# EAGLE design picopter_tx (EAGLE 6.5.0)
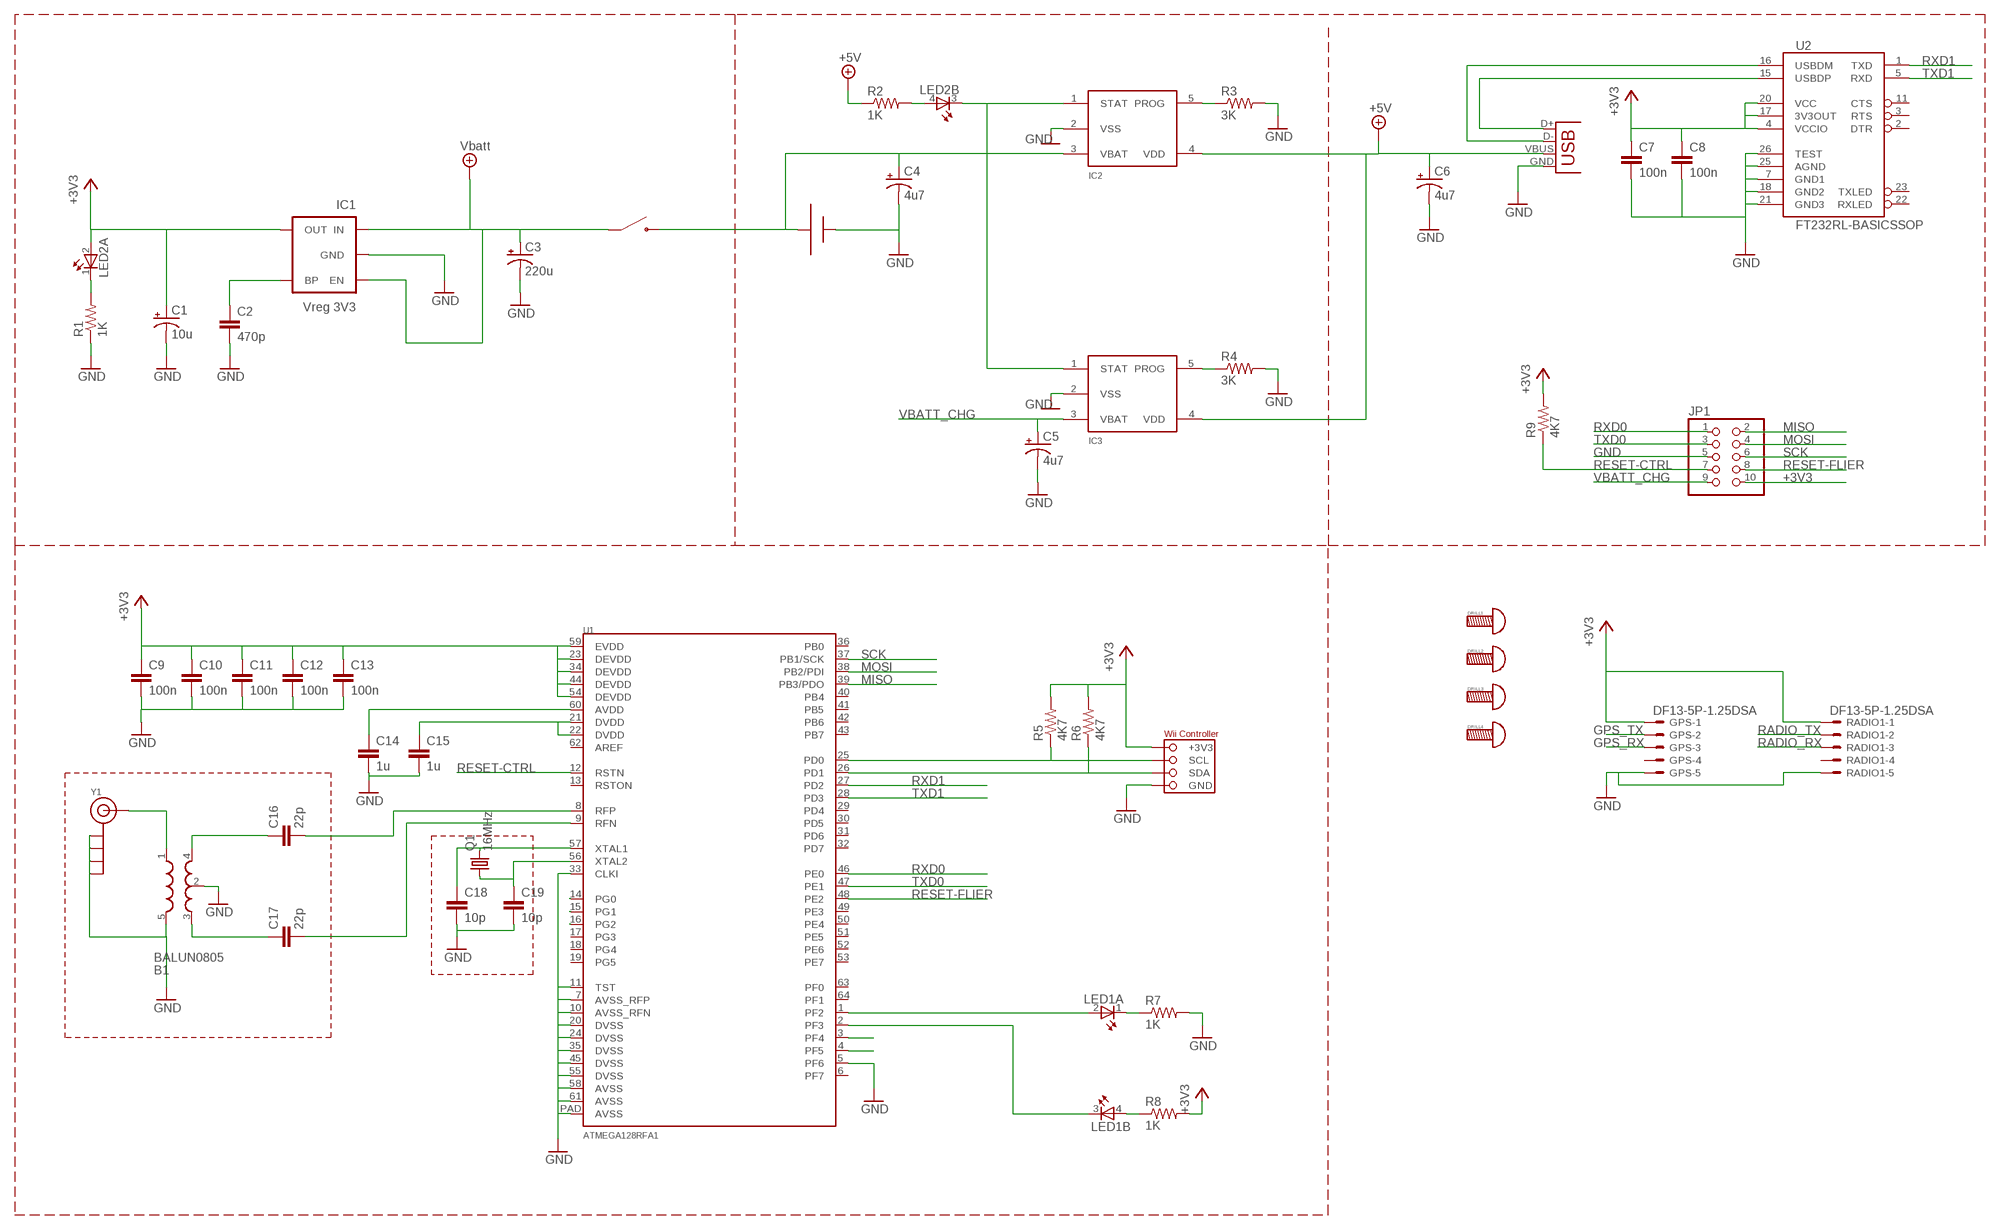
[diagram p0: schematic, sheet 1]

## Parts
B1  BALUN0805  [BALUN]
BATT2  BATT-CONNJST-PH-90  [JST-PH-2-90]
C1  10u  CPOL-USSMCB  [SMC_B]
C2  470p  C-EUC0603  [C0603]
C3  220u  CPOL-USSMCB  [SMC_B]
C4  4u7  CPOL-USSMCB  [SMC_B]
C5  4u7  CPOL-USSMCB  [SMC_B]
C6  4u7  CPOL-USSMCB  [SMC_B]
C7  100n  C-EUC0603  [C0603]
C8  100n  C-EUC0603  [C0603]
C9  100n  C-EUC0603  [C0603]
C10  100n  C-EUC0603  [C0603]
C11  100n  C-EUC0603  [C0603]
C12  100n  C-EUC0603  [C0603]
C13  100n  C-EUC0603  [C0603]
C14  1u  C-EUC0603  [C0603]
C15  1u  C-EUC0603  [C0603]
C16  22p  C-EUC0603  [C0603]
C17  22p  C-EUC0603  [C0603]
C18  10p  C-EUC0603  [C0603]
C19  10p  C-EUC0603  [C0603]
DRILL1  HOLE-4-40  [HOLE-4-40]
DRILL2  HOLE-4-40  [HOLE-4-40]
DRILL3  HOLE-4-40  [HOLE-4-40]
DRILL4  HOLE-4-40  [HOLE-4-40]
GPS  DF13-5P-1.25DSA  [DF13-5P-1.25DSA]
IC1  Vreg 3V3  V_REG_LDOSMD  [SOT23-5]
IC2  MCP-LI-CHARGER-1  [SOT23-5]
IC3  MCP-LI-CHARGER-1  [SOT23-5]
JP1  PINHD-2X5EDGE  [2X5-EDGE]
LED1  TOPLED-2-CUSTOM  [TOPLED2CUSTOM]
LED2  TOPLED-2-CUSTOM  [TOPLED2CUSTOM]
Q1  16MHz  CRYSTALCTS406  [CTS406]
R1  1K  R-US_R0603  [R0603]
R2  1K  R-US_R0603  [R0603]
R3  3K  R-US_R0603  [R0603]
R4  3K  R-US_R0603  [R0603]
R5  4K7  R-US_R0603  [R0603]
R6  4K7  R-US_R0603  [R0603]
R7  1K  R-US_R0603  [R0603]
R8  1K  R-US_R0603  [R0603]
R9  4K7  R-US_R0603  [R0603]
RADIO1  DF13-5P-1.25DSA  [DF13-5P-1.25DSA]
S1  SWITCH-PWR-CNKOS2  [SWITCH-SPDT-CNK-OS2]
U1  ATMEGA128RFA1  [QFN-64]
U2  FT232RL-BASICSSOP  [SSOP28DB]
USB  USB-SMD-NS  [USB-MINIB-NOSTOP]
X11  WII-CONN  [WII-CONN-2]
Y1  SMA_EDGE  [SMA-EDGE]

## Nets
+3V3: C1.+ C7.1 C8.1 C9.1 C10.1 C11.1 C12.1 C13.1 GPS.1 IC1.5(OUT) JP1.10 LED2.2(A:A) R5.2 R6.2 R8.2 R9.2 RADIO1.1 U1.23(DEVDD) U1.34(DEVDD) U1.44(DEVDD) U1.54(DEVDD) U1.59(EVDD) U2.4(VCCIO) U2.17(3V3OUT) U2.20(VCC) X11.+3V3
GND: B1.2(GND) B1.5(GND) BATT2.N C1.- C2.2 C3.- C4.- C5.- C6.- C7.2 C8.2 C9.2 C10.2 C11.2 C12.2 C13.2 C14.2 C15.2 C18.2 C19.2 GPS.5 IC1.2(GND) IC2.2(VSS) IC3.2(VSS) JP1.5 R1.1 R3.2 R4.2 R7.2 RADIO1.5 U1.5(PF6) U1.7(AVSS_RFP) U1.10(AVSS_RFN) U1.11(TST) U1.20(DVSS) U1.24(DVSS) U1.33(CLKI) U1.35(DVSS) U1.45(DVSS) U1.55(DVSS) U1.58(AVSS) U1.61(AVSS) U1.PAD(AVSS) U2.7(GND1) U2.18(GND2) U2.21(GND3) U2.25(AGND) U2.26(TEST) USB.GND X11.GND Y1.GND@0(GND) Y1.GND@1(GND) Y1.GND@2(GND) Y1.GND@3(GND)
GPS_RX: GPS.3
GPS_TX: GPS.2
MISO: JP1.2 U1.39(PB3/PDO)
MOSI: JP1.4 U1.38(PB2/PDI)
N$1: LED1.2(A:A) U1.1(PF2)
N$2: LED1.1(A:C) R7.1
N$3: LED1.4(B:A) R8.1
N$4: LED2.4(B:A) R2.2
N$6: U1.14(PG0)
N$7: U1.15(PG1)
N$8: U1.16(PG2)
N$9: LED2.1(A:C) R1.2
N$11: IC2.5(PROG) R3.1
N$15: IC3.5(PROG) R4.1
N$17: U2.16(USBDM) USB.D-
N$18: U2.15(USBDP) USB.D+
N$21: U1.3(PF4)
N$22: U1.4(PF5)
N$25: C2.1 IC1.4(BP)
N$26: C15.1 U1.21(DVDD) U1.22(DVDD)
N$27: C14.1 U1.60(AVDD)
N$28: B1.1(IN) Y1.SIG(SIGNAL)
N$29: B1.3(OUT1) C17.1
N$30: B1.4(OUT2) C16.1
N$31: C16.2 U1.8(RFP)
N$32: C17.2 U1.9(RFN)
N$33: C18.1 Q1.3 U1.57(XTAL1)
N$34: C19.1 Q1.1 U1.56(XTAL2)
N$38: IC2.1(STAT) IC3.1(STAT) LED2.3(B:C)
N$39: BATT2.P C4.+ IC2.3(VBAT) S1.2
N$41: LED1.3(B:C) U1.2(PF3)
RADIO_RX: RADIO1.3
RADIO_TX: RADIO1.2
RESET-CTRL: JP1.7 R9.1 U1.12(RSTN)
RESET-FLIER: JP1.8 U1.48(PE2)
RXD0: JP1.1 U1.46(PE0)
RXD1: U1.27(PD2) U2.1(TXD)
SCK: JP1.6 U1.37(PB1/SCK)
SCL: R5.1 U1.25(PD0) X11.SCL
SDA: R6.1 U1.26(PD1) X11.SDA
TXD0: JP1.3 U1.47(PE1)
TXD1: U1.28(PD3) U2.5(RXD)
VBATT: C3.+ IC1.1(IN) IC1.3(EN) S1.1 ; supply symbol labelled Vbatt
VBATT_CHG: C5.+ IC3.3(VBAT) JP1.9
VUSB: C6.+ IC2.4(VDD) IC3.4(VDD) R2.1 USB.VBUS ; supply symbol labelled +5V
Unconnected: GPS.4 RADIO1.4 U1.6(PF7) U1.13(RSTON) U1.17(PG3) U1.18(PG4) U1.19(PG5) U1.29(PD4) U1.30(PD5) U1.31(PD6) U1.32(PD7) U1.36(PB0) U1.40(PB4) U1.41(PB5) U1.42(PB6) U1.43(PB7) U1.49(PE3) U1.50(PE4) U1.51(PE5) U1.52(PE6) U1.53(PE7) U1.62(AREF) U1.63(PF0) U1.64(PF1) U2.2(DTR) U2.3(RTS) U2.11(CTS) U2.22(RXLED) U2.23(TXLED)

## Library data of the parts
B1 = palmquad_alpha:BALUN
BATT2 = palmquad_alpha:BATT-CONN
C1 C3-C6 = rcl:CPOL-US: POLARIZED CAPACITOR, American symbol
C2 C7-C19 = rcl:C-EU: CAPACITOR, European symbol
DRILL1-DRILL4 = palmquad_alpha:HOLE
GPS RADIO1 = pixhawk2:DF13-5P-1.25?
IC1 = palmquad_alpha:V_REG_LDO: Voltage Regulator LDO Standard 150mA LDO voltage regulator in SOT-23 layout. Micrel part MIC5205. BP (by-pass) pin is used to lower output noise with 470pF cap.
IC2 IC3 = palmquad_alpha:MCP-LI-CHARGER-1
JP1 = palmquad_alpha:PINHD-2X5: PIN HEADER
LED1 LED2 = palmquad_alpha:TOPLED-2-: Multi TOPLED® (two color) LG T672, LP T672 LSY T67B LSW T67C LSY T675 LSY T676 LSG T677 LSG T770 Source: http://www.osram.convergy.de/
Q1 = palmquad_alpha:CRYSTAL: CRYSTAL; OC_FARNELL: unknown; OC_NEWARK: unknown
R1-R9 = rcl:R-US_: RESISTOR, American symbol
S1 = palmquad_alpha:SWITCH-PWR
U1 = palmquad_alpha:ATMEGA128RFA1
U2 = palmquad_alpha:FT232RL-BASIC: USB UART This is the simplified version of the FT232RL unit. Only what you need, nothing you don't. Spark Fun Electronics SKU : COM-00650
USB = palmquad_alpha:USB: USB Connectors USB-B-PTH is fully proven SKU : PRT-00139 USB-miniB is fully proven SKU : PRT-00587 USB-A-PCB is untested. USB-A-H is throughly reviewed, but untested. Spark Fun Electronics SKU : PRT-00437 USB-B-SMT is throughly reviewed, but untested. Needs silkscreen touching up. USB-A-S has not been used/tested USB-MB-H has not been used/tested
X11 = palmquad_alpha:WII-CONN
Y1 = palmquad_alpha:SMA_EDGE: SMA Antenna Connector End launch SMA connector. The paste layer has been removed so that the connector can be hand soldered onto the board after reflow.

## Board
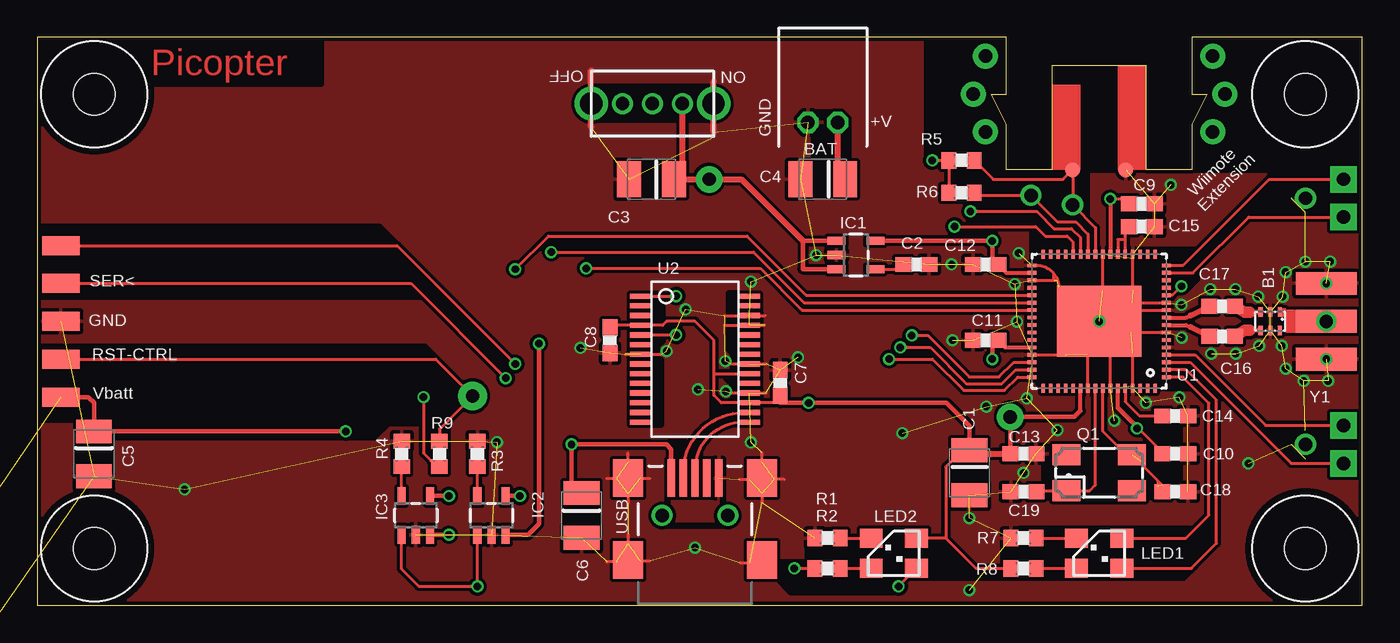
[diagram p1: board, top side]
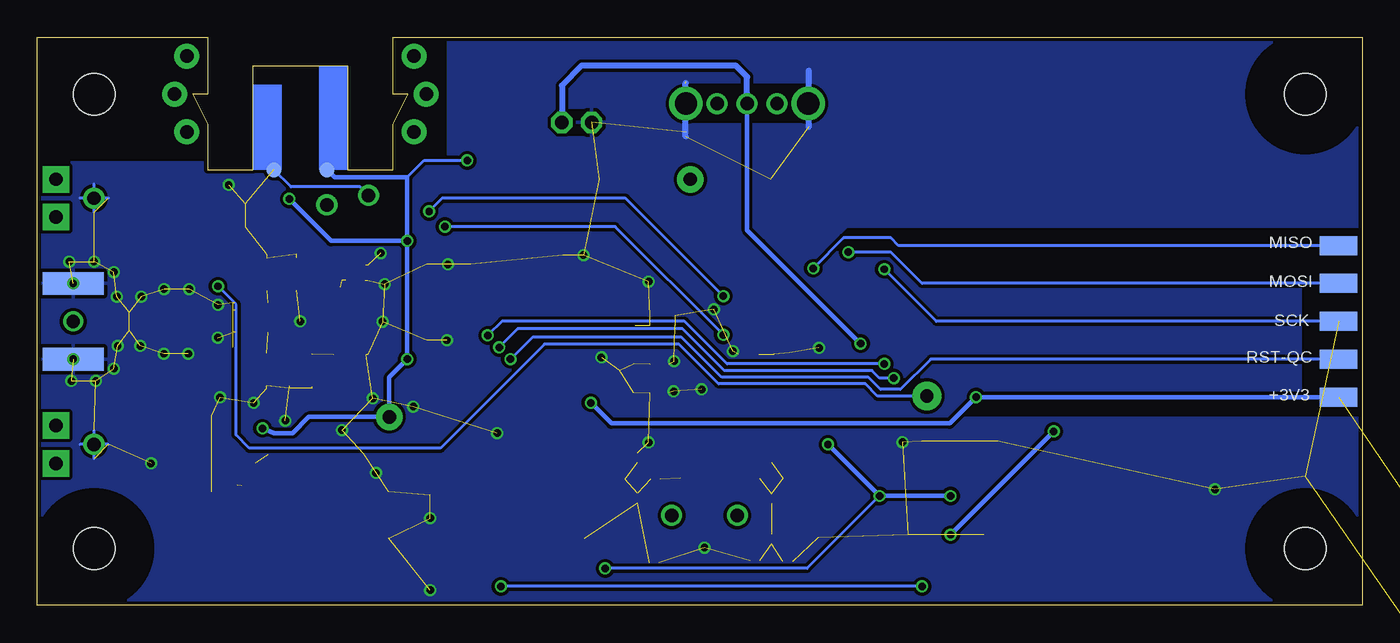
[diagram p2: board, bottom side, seen from below]

Size 88.9 x 38.1 mm. Coordinates in mm from the lower left corner, seen from the top.
Outline: 0,0 88.9,0 88.9,38.1 77.47,38.1 77.47,34.29 78.49,34.29 77.47,32.26 77.47,29.21 74.42,29.21 74.42,36.2 68.07,36.2 68.07,29.21 65.02,29.21 65.02,32.26 64.01,34.29 65.02,34.29 65.02,38.1 0,38.1 0,0
Copper layers (1*16): Top 0.035mm / dielectric 1.5mm / Bottom 0.035mm
Design rules "fusion_rules_tentedvias": minimum track width 6mil, minimum drill 0.3mm, track to track 7mil, track to pad 7mil, pad to pad 7mil, via to via 7mil, smd to smd 0mil, copper to edge 10mil, drill to drill 10mil, minimum pad ring 10mil, minimum via ring 6mil, stop-mask expansion 2mil, vias tented up to drill 25mil, thermal gap 10mil
tRestrict: area 67.1,14.9 to 75.4,23.2; 118 lines
bRestrict: 12 lines

### Footprints (pad centres in the part's own frame; a part is rotated, then mirrored left to right if it is on the bottom)
BALUN = smd 0.27 x 0.635: 1 -0.7,-0.616; 2 -0.05,-0.616; 3 0.6,-0.616; 4 0.6,0.616; 5 -0.05,0.616; 6 -0.7,0.616
JST-PH-2-90 = drill 0.9 pad 1.422 octagon: N -1,0; P 1,0
SMC_B = smd 1.6 x 2.4: + -1.5,0; - 1.5,0
C0603 = smd 1.1 x 1: 1 -0.85,0; 2 0.85,0
HOLE-4-40 = hole 2.794: 0,0
DF13-5P-1.25DSA = drill 0.5 pad 0.8 long: 1 -2.5,0; 2 -1.25,0; 3 0,0; 4 1.25,0; 5 2.5,0
SOT23-5 = smd 0.55 x 1.2: 1 -0.95,-1.3; 2 0,-1.3; 3 0.95,-1.3; 4 0.95,1.3; 5 -0.95,1.3
2X5-EDGE = smd 2.54 x 1.27: 1 0,5.08; 3 0,2.54; 5 0,0; 7 0,-2.54; 9 0,-5.08 | smd 2.54 x 1.27 bottom: 2 0,5.08; 4 0,2.54; 6 0,0; 8 0,-2.54; 10 0,-5.08
TOPLED2CUSTOM = smd 1.27 x 1.524: 1 -1.016,-1.524; 2 -1.016,1.524; 3 1.016,1.524; 4 1.016,-1.524
CTS406 = smd 1.9 x 1.4: 1 -2.2,-1.2; 2 2.2,-1.2; 3 2.2,1.2; 4 -2.2,1.2
R0603 = smd 1 x 1.1: 1 -0.85,0; 2 0.85,0
SWITCH-SPDT-CNK-OS2 = drill 0.9: 1 0,2.007; 2 0,0; 3 0,-2.007 | drill 1.499 pad 1.905: P$4 0,4.102; P$5 0,-4.102
QFN-64 = smd 0.6 x 0.25: 1 -4.5,3.75; 2 -4.5,3.25; 3 -4.5,2.75; 4 -4.5,2.25; 5 -4.5,1.75; 6 -4.5,1.25; 7 -4.5,0.75; 8 -4.5,0.25; 9 -4.5,-0.25; 10 -4.5,-0.75; 11 -4.5,-1.25; 12 -4.5,-1.75; 13 -4.5,-2.25; 14 -4.5,-2.75; 15 -4.5,-3.25; 16 -4.5,-3.75; 33 4.5,-3.75; 34 4.5,-3.25; 35 4.5,-2.75; 36 4.5,-2.25; 37 4.5,-1.75; 38 4.5,-1.25; 39 4.5,-0.75; 40 4.5,-0.25; 41 4.5,0.25; 42 4.5,0.75; 43 4.5,1.25; 44 4.5,1.75; 45 4.5,2.25; 46 4.5,2.75; 47 4.5,3.25; 48 4.5,3.75 | smd 0.25 x 0.6: 17 -3.75,-4.5; 18 -3.25,-4.5; 19 -2.75,-4.5; 20 -2.25,-4.5; 21 -1.75,-4.5; 22 -1.25,-4.5; 23 -0.75,-4.5; 24 -0.25,-4.5; 25 0.25,-4.5; 26 0.75,-4.5; 27 1.25,-4.5; 28 1.75,-4.5; 29 2.25,-4.5; 30 2.75,-4.5; 31 3.25,-4.5; 32 3.75,-4.5; 49 3.75,4.5; 50 3.25,4.5; 51 2.75,4.5; 52 2.25,4.5; 53 1.75,4.5; 54 1.25,4.5; 55 0.75,4.5; 56 0.25,4.5; 57 -0.25,4.5; 58 -0.75,4.5; 59 -1.25,4.5; 60 -1.75,4.5; 61 -2.25,4.5; 62 -2.75,4.5; 63 -3.25,4.5; 64 -3.75,4.5 | smd 5.639 x 4.75: PAD 0,0
SSOP28DB = smd 0.348 x 1.397: 1 -4.225,-3.656; 2 -3.575,-3.656; 3 -2.925,-3.656; 4 -2.275,-3.656; 5 -1.625,-3.656; 6 -0.975,-3.656; 7 -0.325,-3.656; 8 0.325,-3.656; 9 0.975,-3.656; 10 1.625,-3.656; 11 2.275,-3.656; 12 2.925,-3.656; 13 3.575,-3.656; 14 4.225,-3.656; 15 4.225,3.656; 16 3.575,3.656; 17 2.925,3.656; 18 2.275,3.656; 19 1.625,3.656; 20 0.975,3.656; 21 0.325,3.656; 22 -0.325,3.656; 23 -0.975,3.656; 24 -1.625,3.656; 25 -2.275,3.656; 26 -2.925,3.656; 27 -3.575,3.656; 28 -4.225,3.656
USB-MINIB-NOSTOP = smd 2.5 x 0.5: D+ 2.5,0; D- 2.5,0.8; GND 2.5,-1.6; ID 2.5,-0.8; VBUS 2.5,1.6 | smd 2.5 x 2: G1 -3,-4.5; G2 -3,4.5; G3 2.5,4.5; G4 2.5,-4.5 | drill 0.9 pad 0.8: H1 0,2.2 | drill 0.9 pad 0.787: H2 0,-2.2
WII-CONN-2 = smd 1.016 x 1.016 bottom: +3V3 1.778,7.62; SDA -1.778,7.62 | smd 1.016 x 1.016: GND -1.778,7.62; SCL 1.778,7.62 | drill 0.9 pad 1.676: P$4 -7.62,0; P$5 7.62,0; P$6 -7.62,5.08; P$7 7.62,5.08; P$11 -8.445,2.54; P$12 8.445,2.54
SMA-EDGE = smd 1.524 x 4.064: GND@0 0,0; GND@1 5.08,0; SIG 2.54,0 | smd 1.524 x 4.064 bottom: GND@2 0,0; GND@3 5.08,0

### Placement (x,y rotation side)
B1  82.68,19.05 180 top
BATT2  52.7,32.38 0 top
C1  62.55,8.89 270 top
C2  58.99,22.86 0 top
C3  41.21,28.57 180 top
C4  52.7,28.57 180 top
C5  3.81,10.16 270 top
C6  36.51,6.03 270 top
C7  49.85,14.92 90 top
C8  38.42,17.78 270 top
C9  74.1,26.92 0 top
C10  76.35,10.16 0 top
C11  63.63,17.78 180 top
C12  63.63,22.86 180 top
C13  66.17,10.16 0 top
C14  76.35,12.7 0 top
C15  74.1,25.4 0 top
C16  79.5,18.03 180 top
C17  79.5,20.07 180 top
C18  76.35,7.62 0 top
C19  66.17,7.62 180 top
DRILL1  3.81,3.81 0 top
DRILL2  85.09,3.81 0 top
DRILL3  3.81,34.29 0 top
DRILL4  85.09,34.29 0 top
GPS  -41.27,-57.15 0 top  (outside the outline)
IC1  54.93,23.5 270 top
IC2  30.48,6.03 0 top
IC3  25.4,6.03 0 top
JP1  1.59,19.05 0 top
LED1  71.25,3.49 270 top
LED2  57.47,3.49 270 top
Q1  71.25,8.89 0 top
R1  53.02,4.51 0 top
R2  53.02,2.48 0 top
R3  29.53,10.16 90 top
R4  24.45,10.16 90 top
R5  62.01,29.84 180 top
R6  62.01,27.67 180 top
R7  66.17,4.51 180 top
R8  66.17,2.48 180 top
R9  26.99,10.16 270 top
RADIO1  -41.27,-52.7 0 top  (outside the outline)
S1  41.27,33.66 270 top
U1  71.25,19.05 180 top
U2  44.13,16.51 270 top
U$1  [MOCKQC]  -45.72,0 0 top  (outside the outline)
U$2  [PICOPTER-LOGO]  7.62,35.56 0 top
U$5  [ARM-MOCK]  -10.16,35.56 45 top  (outside the outline)
U$8  [ARM-MOCK]  -10.16,2.54 315 top  (outside the outline)
USB  44.13,6.03 90 top
X11  71.25,36.83 180 top
Y1  86.49,16.51 90 top

### Tracks (layer width: path | path; a pad name or v marks a point on that pad's centre or on a via)
+3V3  (via drill 0.5, 0.9 pad 1.78)  (2 unrouted)
  Top 0.203: C13.1 65.29,10.19 | C13.1 65.32,10.23 | C10.1 75.48,10.27 73.73,12.01 73.53,12.01 | C13.1 65.28,10.16 | 64.07,17.38 C11.1 | v72,27.25 72.92,27.25 C9.1 | v60.06,29.84 R5.2 R6.2 | 60.96,4.51 60.96,9.29 62.06,10.39 C1.+ | C7.1 49.85,13.59 U2.17 45.9,13.59 45.4,14.08 45.4,15.54 | 45.4,15.54 U2.20 | C8.1 38.42,18.79 U2.4 41.96,18.79 42.23,19.05 44.13,19.05 45.4,17.78 45.4,15.54 | 60.96,4.51 LED2.2 | v25.91,13.97 25.91,10.2 26.8,9.31 R9.2 | R8.2 62.99,2.48 60.96,4.51
  Top 0.254: U1.34 65.04,22.3 C12.1 | 64.96,17.3 U1.44 | 70,13.03 U1.54 | 72.5,13.25 U1.59 | v72,27.25 U1.23
  Top 0.305: C11.1 64.96,17.3 | 72.5,13.25 73.73,12.01 73.79,11.96 v73.79,11.87 | 70,13.03 69.6,12.64 v65.28,12.64 65.28,10.16 | v64.07,16.51 64.07,17.38 | C12.1 64.07,23.27 v64.07,24.45 IC1.5 | 49.85,13.59 v51.75,13.59 61.01,13.59 62.55,12.05 C1.+
  Top 0.406: C13.1 62.78,10.16 C1.+
  Bottom 0.203: v60.06,29.84 62.93,29.84 64.07,28.7
  Bottom 0.305: X11.+3V3 68.96,28.7 64.07,28.7 v64.07,24.45 | v73.79,11.87 73.02,11.56 71.75,11.56 70.67,12.64 v65.28,12.64 65.28,15.3 v64.07,16.51 v64.07,24.45 | v64.07,24.45 69.19,24.45 v72,27.25 | JP1.10 v25.91,13.97 27.67,12.21 50.38,12.21 v51.75,13.59
GND  (via drill 0.5)  (134 unrouted)
  Top 0.203: 73.46,20.29 75.64,20.29 | 73.45,19.8 75.64,19.8 | 73.42,18.3 75.6,18.3 | 73.5,14.72 73.5,16.9 | 72,14.73 72,16.92 | 70.5,14.67 70.5,16.86 | 66.84,16.8 69.03,16.8 | 71.5,21.13 71.5,23.32 | 73.5,21.11 73.5,23.29 | 66.86,22.8 67.07,22.8 arc-90 68.53,21.34 | 66.9,21.8 68.45,21.8 | 68.21,21.82 68.21,22.24 | 50.1,8.45 49.47,8.45 | 48.64,9.59 48.64,10.22 | 47.12,8.45 47.75,8.45 | 47.18,2.86 47.82,2.86 | 40.45,2.98 41.08,2.98 | 38.86,2.92 38.23,2.92 | 39.62,4.76 39.62,4.13 | 39.62,7.49 39.62,6.86 | 40.45,8.51 41.08,8.51 | 38.23,8.51 38.86,8.51 | 39.62,9.59 39.62,10.22 | 48.61,7.53 48.61,6.89 | 39.47,16.83 41.85,16.83 | 46.51,16.19 48.9,16.19 | 46.51,14.26 48.9,14.26 | 46.1,18.8 48.8,18.8 | 46.1,19.43 48.83,19.43
  Top 0.406: 37.16,32.07 37.16,35.88 | 45.38,31.73 45.38,35.12
  Bottom 0.203: 85.09,9.84 85.09,11.75 | 84.14,10.79 86.04,10.79 | 84.14,27.3 86.04,27.3 | 85.09,26.35 85.09,28.26
  Bottom 0.406: 37.13,32.07 37.13,35.88 | 45.39,31.43 45.39,35.02
  other vias: 86.49,21.59 86.49,16.51 83.5,17.4 83.76,15.88 81.92,20.7 83.76,22.35 81.98,17.4 80.39,21.21 85.09,23.05 86.74,23.05 84.96,15.05 86.61,15.05 76.77,20.14 76.79,17.95 30.84,10.95 65.85,23.62 61.34,22.86 61.4,17.78 72.26,12.38 66.17,8.89 66.39,13.87 78.76,16.87 80.41,16.87 78.7,21.21 52.26,23.5 76.63,13.95 83.57,20.7 74.38,13.57 65.74,19.03 65.58,21.54 63.68,13.34 68.45,11.75 71.25,19.05 76.06,28.21 46.2,14.35 46.16,16.38 42.23,17.05 44.32,14.48 43.5,19.84 62.53,1.02 62.53,5.84 81.27,9.53 47.88,21.72 47.88,10.92 51.05,16.64 9.89,7.77 44.13,3.87 58.04,11.56 36.45,17.27
  pour Top (isolate 0.216): -0.32,38.42 89.22,38.42 89.22,-0.32 -0.32,-0.32
  pour Bottom (isolate 0.216): -0.32,38.42 89.22,38.42 89.22,-0.32 -0.32,-0.32
MISO  (via drill 0.5)
  Top 0.203: U1.39 51.32,19.8 48.51,22.61 v36.83,22.61
  Bottom 0.203: JP1.2 31.11,24.13 31.62,24.64 34.8,24.64 v36.83,22.61
MOSI  (via drill 0.5)
  Top 0.203: U1.38 51.45,20.3 48.07,23.69 v34.48,23.69
  Bottom 0.203: v34.48,23.69 31.62,23.69 29.53,21.59 JP1.4
N$1
  Top 0.203: U1.1 76.88,15.3 78.61,13.56 78.61,6.04 77.08,4.51 LED1.2
N$2
  Top 0.203: R7.1 LED1.1
N$3
  Top 0.203: R8.1 LED1.4
N$4
  Top 0.203: R2.2 LED2.4
N$7  (via drill 0.9 pad 1.78)
  Top 0.203: U1.15 77.55,22.3 81.28,26.04 v87.63,26.04
N$8  (via drill 0.9 pad 1.78)
  Top 0.203: U1.16 76.88,22.8 82.66,28.57 v87.63,28.57
N$9
  Top 0.203: R1.2 LED2.1
N$10  (via drill 0.9 pad 1.42)
  other vias: 85.09,10.79
N$11
  Top 0.203: IC2.5 R3.1
N$12  (via drill 0.9 pad 1.42)
  other vias: 85.09,27.3
N$15
  Top 0.203: IC3.5 R4.1
  Top 0.254: IC3.5
N$17
  Top 0.203: USB.D- 43.33,8.85 arc-90 47.42,12.94 U2.16
N$18
  Top 0.203: USB.D+ 44.13,9.06 arc-90 47.35,12.29 U2.15
N$21  (via drill 0.9 pad 1.78)
  Top 0.203: U1.3 77.36,16.3 84.14,9.53 v87.63,9.53
N$22  (via drill 0.9 pad 1.78)
  Top 0.203: U1.4 77.69,16.8 82.42,12.06 v87.63,12.06
N$25
  Top 0.203: IC1.4 58.14,22.55 C2.1
N$26
  Top 0.203: U1.21 73,24.52 | 73,24.52 73,25.4 C15.1 | U1.22 72.5,24.52 73,24.52
N$27
  Top 0.203: U1.60 73,13.66 73.96,12.7 C14.1
N$28  (via drill 0.9)
  Top 0.203: 85.99,19.55 Y1.SIG 85.87,19.67 B1.1
  other vias: 86.49,19.05
N$29
  Top 0.305: 81.36,19.67 B1.3
  Top 0.762: 81.36,19.67 81.01,19.67 C17.1
N$30
  Top 0.305: 81.36,18.43 B1.4
  Top 0.762: 81.36,18.43 81.01,18.43 C16.1
N$31
  Top 0.254: U1.8 77.08,18.8 77.37,18.68
  Top 0.406: 77.37,18.68 C16.2
N$32
  Top 0.254: U1.9 77.08,19.3 77.37,19.42
  Top 0.406: 77.37,19.42 C17.2
N$33  (2 unrouted)
  Top 0.203: U1.57 71.5,11.67 73.08,10.09 Q1.3 75.48,8.06 C18.1 | 74.3,9.53 74.3,9.27 | 75.18,8.33 75.18,8.03
N$34
  Top 0.203: Q1.1 69.4,7.69 | U1.56 71,8.08 70.61,7.7 Q1.1 | C19.1 67.09,7.69 Q1.1
N$38  (via drill 0.5)
  Top 0.203: v57.78,1.27 LED2.3 | IC3.1 24.45,2.41 25.59,1.27 v29.53,1.27 IC2.1
  Bottom 0.203: v29.53,1.27 v57.78,1.27
N$39  (via drill 0.5)
  Top 0.305: IC2.3 32.93,4.73 33.66,5.46 v33.66,17.55
  Top 0.406: C4.+ 53.7,29.07 BATT2.P
  Bottom 0.305: v33.66,17.55 40.37,24.27 41.27,25.17 S1.2
  Bottom 0.406: S1.2 41.27,35.44 42.03,36.2 52.37,36.2 53.7,34.86 BATT2.P
N$41
  Top 0.203: U1.2 77.1,15.8 79.12,13.78 79.12,4.15 77.44,2.48 LED1.3
RESET-CTRL  (via drill 0.5, 0.9 pad 1.93)
  Top 0.203: U1.12 76.17,20.8 v76.77,21.4 | JP1.7 26.73,16.51 v29.21,14.03 26.99,11.81 R9.1
  Bottom 0.203: v76.77,21.4 75.56,20.19 75.56,11.43 74.68,10.54 61.85,10.54 54.86,17.53 45.85,17.53 43.18,14.86 33.34,14.86 32.51,14.03 v29.21,14.03
RESET-FLIER  (via drill 0.5)
  Top 0.203: U1.48 65.78,15.3 64.9,14.41 62.17,14.41 60.07,16.51 v57.15,16.51
  Bottom 0.203: v57.15,16.51 55.67,17.99 45.68,17.99 42.99,15.3 33.15,15.3 32.32,14.48 30.99,14.48 28.96,16.51 JP1.8
RXD0  (via drill 0.5)
  Top 0.203: U1.46 65.51,16.3 64.53,15.32 62.53,15.32 59.75,18.1 v58.67,18.1 | v32.07,16.19 24.13,24.13 JP1.1
  Bottom 0.203: v32.07,16.19 42.61,16.19 45.47,19.05 57.72,19.05 v58.67,18.1
RXD1  (via drill 0.5)
  Top 0.203: U1.27 70,24.67 69.4,25.27 68.2,25.27 67.06,26.42 v62.61,26.42 | U2.1 v42.86,20.73
  Bottom 0.203: v42.86,20.73 49.43,27.3 61.72,27.3 v62.61,26.42
SCK  (via drill 0.5)
  Top 0.203: U1.37 51.59,20.8 47.62,24.77 34.29,24.77 v32.07,22.54
  Bottom 0.203: v32.07,22.54 28.57,19.05 JP1.6
SCL  (via drill 0.9 pad 1.42)
  Top 0.203: 62.86,29.8 R5.1 64.15,28.56 68.82,28.56 X11.SCL v69.47,26.86 71,25.33 U1.25
SDA  (via drill 0.9 pad 1.42)
  Top 0.203: U1.26 70.5,24.9 69.68,25.72 68.45,25.72 v66.67,27.5 63.04,27.5 R6.1
  Bottom 0.203: X11.SDA 71.88,28.07 67.25,28.07 v66.67,27.5
TXD0  (via drill 0.5)
  Top 0.203: U1.47 65.65,15.8 64.71,14.86 62.36,14.86 59.91,17.3 v57.91,17.3 | v31.43,15.24 25.08,21.59 JP1.3
  Bottom 0.203: v31.43,15.24 32.38,15.24 32.89,15.75 42.8,15.75 45.59,18.54 56.67,18.54 v57.91,17.3
TXD1  (via drill 0.5)
  Top 0.203: U1.28 69.5,24.38 69.11,24.77 67.63,24.77 66.99,25.4 v61.55,25.4 | U2.5 v42.86,18.14
  Bottom 0.203: v42.86,18.14 50.13,25.4 v61.55,25.4
VBATT  (via drill 0.9 pad 1.78)
  Top 0.305: IC1.1 51.37,24.45 51.37,22.55 IC1.3
  Top 0.406: S1.1 43.28,29.14 C3.+ v45.09,28.57 47.24,28.57 51.37,24.45
VBATT_CHG  (via drill 0.5)
  Top 0.305: JP1.9 3.42,13.97 3.81,13.58 C5.+ v20.7,11.66 | v27.62,4.73 IC3.3
  Bottom 0.305: v20.7,11.66 v27.62,4.73
VUSB  (via drill 0.5)
  Top 0.203: R2.1 52.17,2.5 52.13,2.48 v50.8,2.48
  Top 0.305: IC3.4 v27.62,7.33 | v32.38,7.33 IC2.4 | USB.VBUS 42.53,10.48 42.22,10.79 v35.85,10.79 35.85,7.53 C6.+
  Bottom 0.203: v50.8,2.48 37.24,2.48 v32.38,7.33
  Bottom 0.305: v27.62,7.33 v32.38,7.33 v35.85,10.79
(copper drawn outside any net)
  shapes: Top area x2

### Text on the board
_tsilk: OFF | ON | BAT | Wiimote | Extension | SER< | GND | RST-CTRL | Vbatt
_bsilk: MISO | MOSI | SCK | RST-QC | +3V3